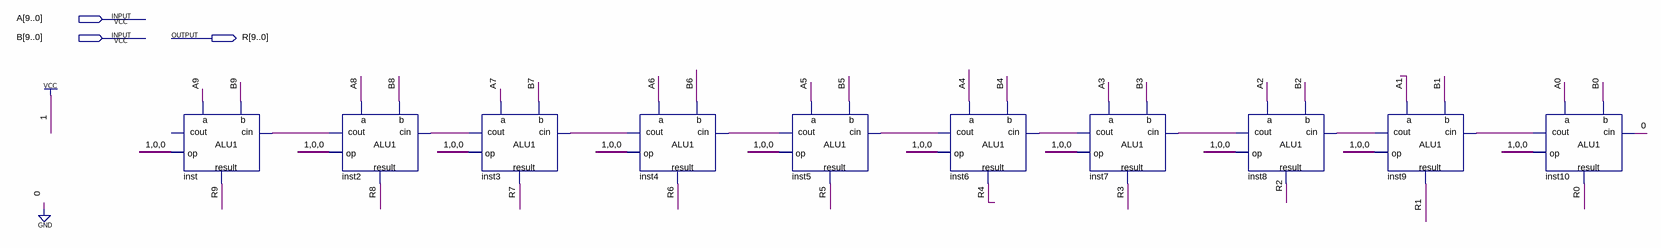
[diagram p0: schematic sheet]
// Quartus schematic Sabirac10.bdf as structural Verilog: 10 symbols, 3 pins
module Sabirac10 (
  input  [9:0] A,
  input  [9:0] B,
  output [9:0] R
);

  wire inst2_cout, inst3_cout, inst4_cout, inst5_cout, inst6_cout, inst7_cout, inst8_cout, inst9_cout,
       inst10_cout;

  ALU1 inst (.a(A[9]), .b(B[9]), .cin(inst2_cout), .op(3'b100), .result(R[9]));  // open: cout
  ALU1 inst2 (.a(A[8]), .b(B[8]), .cin(inst3_cout), .op(3'b100), .cout(inst2_cout), .result(R[8]));
  ALU1 inst3 (.a(A[7]), .b(B[7]), .cin(inst4_cout), .op(3'b100), .cout(inst3_cout), .result(R[7]));
  ALU1 inst4 (.a(A[6]), .b(B[6]), .cin(inst5_cout), .op(3'b100), .cout(inst4_cout), .result(R[6]));
  ALU1 inst5 (.a(A[5]), .b(B[5]), .cin(inst6_cout), .op(3'b100), .cout(inst5_cout), .result(R[5]));
  ALU1 inst6 (.a(A[4]), .b(B[4]), .cin(inst7_cout), .op(3'b100), .cout(inst6_cout), .result(R[4]));
  ALU1 inst7 (.a(A[3]), .b(B[3]), .cin(inst8_cout), .op(3'b100), .cout(inst7_cout), .result(R[3]));
  ALU1 inst8 (.a(A[2]), .b(B[2]), .cin(inst9_cout), .op(3'b100), .cout(inst8_cout), .result(R[2]));
  ALU1 inst9 (.a(A[1]), .b(B[1]), .cin(inst10_cout), .op(3'b100), .cout(inst9_cout), .result(R[1]));
  ALU1 inst10 (.a(A[0]), .b(B[0]), .cin(1'b0), .op(3'b100), .cout(inst10_cout), .result(R[0]));
endmodule
